# EAGLE schematic BB-Powersupply+KNX-Connection - v1.0.0 (EAGLE 9.6.2)
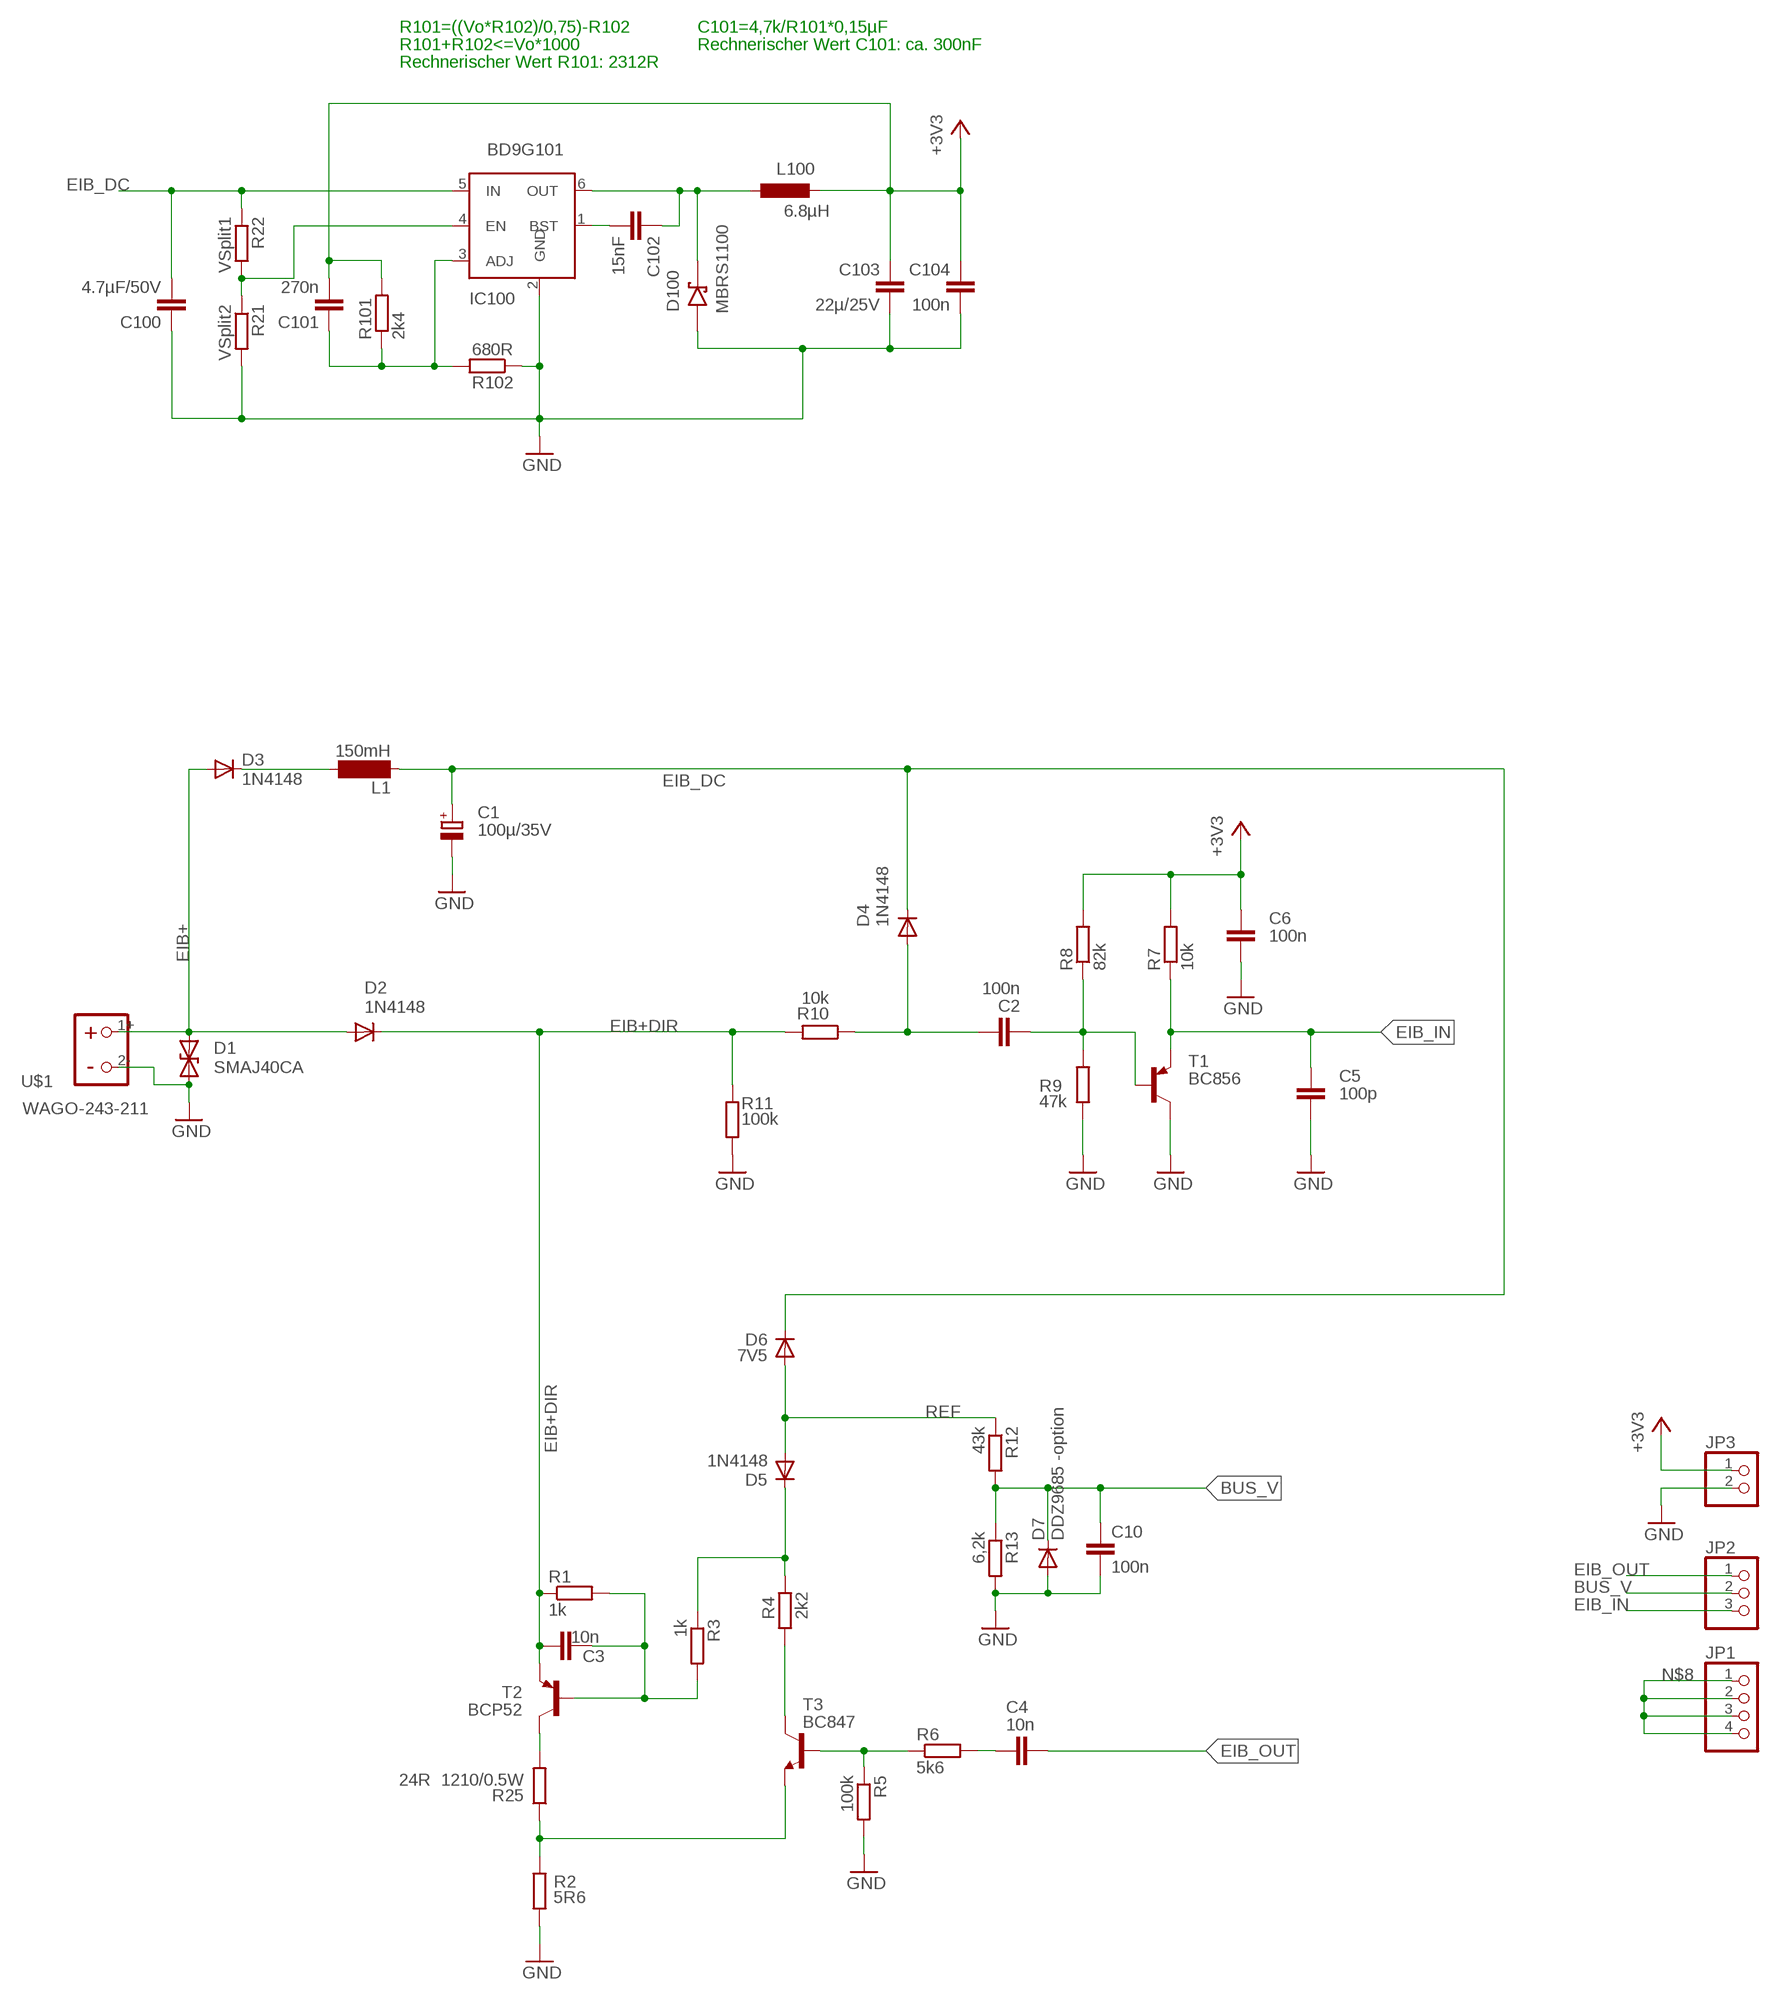
[diagram p0: schematic, sheet 1]

## Parts
C1  100µ/35V  CPOL-EUSANYO_SMD_C6  [SANYO-OSCON_SMD_C6]
C2  100n  C-EUC0805  [C0805]
C3  10n  C-EUC0805  [C0805]
C4  10n  C-EUC0805  [C0805]
C5  100p  C-EUC0805  [C0805]
C6  100n  C-EUC0805  [C0805]
C10  100n  C-EUC0805  [C0805]
C100  4.7µF/50V  C-EUC0805  [C0805]
C101  270n  C-EUC0805  [C0805]
C102  15nF  C-EUC0805  [C0805]
C103  22µ/25V  C-EUC1206  [C1206]
C104  100n  C-EUC0805  [C0805]
D1  SMAJ40CA  [DO214AC]
D2  1N4148  DIODESOD-123  [SOD-123]
D3  1N4148  DIODESOD-123  [SOD-123]
D4  1N4148  DIODESOD-123  [SOD-123]
D5  1N4148  DIODESOD-123  [SOD-123]
D6  7V5  DIODESOD-123  [SOD-123]
D7  DDZ9685 -option  DIODESOD-123  [SOD-123]
D100  MBRS1100  SCHOTTKY-DIODE-MBR130LSFT1  [SOD123FL]
IC100  BD9G101  BD9G101GBD9G101G-SOT23-6  [SOT23-6]
JP1  PINHD-1X4  [1X04]
JP2  PINHD-1X3  [1X03]
JP3  PINHD-1X2  [1X02]
L1  150mH  BS11  [BS11]
L100  6.8µH  L-EUL4532P  [L4532P]
R1  1k  R-EU_R0805  [R0805]
R2  5R6  R-EU_R0805  [R0805]
R3  1k  R-EU_R0805  [R0805]
R4  2k2  R-EU_R0805  [R0805]
R5  100k  R-EU_R0805  [R0805]
R6  5k6  R-EU_R0805  [R0805]
R7  10k  R-EU_R0805  [R0805]
R8  82k  R-EU_R0805  [R0805]
R9  47k  R-EU_R0805  [R0805]
R10  10k  R-EU_R0805  [R0805]
R11  100k  R-EU_R0805  [R0805]
R12  43k  R-EU_R0805  [R0805]
R13  6,2k  R-EU_R0805  [R0805]
R21  VSplit2  R-EU_R0805  [R0805]
R22  VSplit1  R-EU_R0805  [R0805]
R25  24R 1210/0.5W  R-EU_R2512  [R2512]
R101  2k4  R-EU_R0805  [R0805]
R102  680R  R-EU_R0805  [R0805]
T1  BC856  BC856BSMD  [SOT23-BEC]
T2  BCP52  FZT753SMD  [SOT223]
T3  BC847  [SOT23]
U$1  WAGO-243-211  [WAGO-243-211]

## Nets
+3V3: C6.2 C101.2 C103.1 C104.1 JP3.1 L100.2 R7.2 R8.2 R101.2
BST: C102.2 IC100.1(BST)
BUS_V: C10.2 D7.C JP2.2 R12.2 R13.1
EIB+: D1.C D2.A D3.A U$1.1+
EIB+DIR: C3.1 D2.C R1.1 R10.2 R11.2 T2.3(E)
EIB_DC: C1.+ C100.2 D4.C D6.C IC100.5(IN) L1.1 R22.1
EIB_IN: C5.2 JP2.3 R7.1 T1.E
EIB_OUT: C4.2 JP2.1
FB: C101.1 IC100.3(ADJ) R101.1 R102.2
GND: C1.- C5.1 C6.1 C10.1 C100.1 C103.2 C104.2 D1.A D7.A D100.A IC100.2(GND) JP3.2 R2.1 R5.2 R9.1 R11.1 R13.2 R21.2 R102.1 T1.C U$1.2-
LX: C102.1 D100.C IC100.6(OUT) L100.1
N$1: C2.2 D4.A R10.1
N$2: D3.C L1.2
N$3: C4.1 R6.2
N$5: IC100.4(EN) R21.1 R22.2
N$6: R4.1 T3.3(C)
N$7: R2.2 R25.1 T3.2(E)
N$8: JP1.1 JP1.2 JP1.3 JP1.4 R25.2 T2.2(C) T2.4(C)
N$12: R5.1 R6.1 T3.1(B)
N$14: C2.1 R8.1 R9.2 T1.B
N$15: C3.2 R1.2 R3.2 T2.1(B)
N$25: D5.C R3.1 R4.2
REF: D5.A D6.A R12.1

## Notes on the sheet
- R101=((Vo*R102)/0,75)-R102 | C101=4,7k/R101*0,15µF
- R101+R102<=Vo*1000 | Rechnerischer Wert C101: ca. 300nF
- Rechnerischer Wert R101: 2312R

## Library data of the parts
C1 = rcl:CPOL-EU: POLARIZED CAPACITOR, European symbol; REICHELT: VF 100/35 K-D8; SPICEPREFIX: C
C2 C10 C104 = rcl:C-EU: CAPACITOR, European symbol; REICHELT: X7R-G0805 100N; SPICEPREFIX: C
C3 C4 C6 = rcl:C-EU: CAPACITOR, European symbol; REICHELT: X7R-G0805 10N; SPICEPREFIX: C
C5 = rcl:C-EU: CAPACITOR, European symbol; REICHELT: NPO-G0805 100P; SPICEPREFIX: C
C100 = rcl:C-EU: CAPACITOR, European symbol; REICHELT: X7R-G1206 4,7/50; SPICEPREFIX: C
C101 = rcl:C-EU: CAPACITOR, European symbol; REICHELT: Y5R-G0603 220N; SPICEPREFIX: C
C102 = rcl:C-EU: CAPACITOR, European symbol; REICHELT: X7R-G0805 15N; SPICEPREFIX: C
C103 = rcl:C-EU: CAPACITOR, European symbol; REICHELT: X5R-G0805 22/6; SPICEPREFIX: C
D1 = smaj_10:SMAJ*CA: SMAJ Series TVS Diodes Source: http://www.littelfuse.com/~/media/electronics/datasheets/tvs_diodes/littelfuse_tvs_diode_smaj_datasheet.pdf.pdf; MF: Littelfuse; MPN: SMAJ40CA; OC_FARNELL: 1827675; OC_NEWARK: 71J2019
D2-D5 = microbuilder:DIODE: Diode SMA Model Volts Amps Type Vf Vr Digikey # Notes SSA34-E3 40V 3A Schottky 480mV @ 3A 200uA @ 40V SSA34-E3/61TGITR-ND CDBA120-G 20V 1A Schottky 500mV @ 1A 500uA @ 20V 641-1014-6-ND REEL MBRA210 10V 2A Schottky 350mV @ 2A 700uA @ 10V MBRA210LT3 SOD-123 Model Volts Amps Type Vf Vr Order # Notes BAT54T1G 30V 200mA Schottky 800mV @ 200mA 2uA @ 25V BAT54T1GOSTR-ND B0530W 30V 500mA Schottky 430mV @ 500mA 130uA @ 30V B0530W-FDICT-ND REEL MBR120 1A 20V Schottky 340mV @ 1A MBR120VLSFT1GOSCT-ND SOD-323 Model Volts Amps Type Vf Vr Order # Notes PMEG2005EJ 20V 500mA Schottky 355mV @ 500mA 568-4110-1-ND ZLLS410 10V 570mA Schottky 380mV @ 570mA ZLLS410CT-ND 1N4148WS 75V 150mA Silicon/Simple 1V 1N4148WSFSCT-ND REEL SOD-523 Model Volts Amps Type Vf Vr Order # Notes BAT54XV2 30V 200mA Schottky 0.8V @ 100mA BAT54XV2CT-ND TB751S 30V 30mA Schottky RB751S-40TE61CT-ND SOT23-R/W (R = Solder Paste/Reflow Ovens, W = Hand-Soldering) Model Volts Amps Type Vf Vr Order # Notes BAT54FILM 40V 300mA Schottky 497-7162-1-ND; REICHELT: 1N 4148 SMD
D6 = microbuilder:DIODE: Diode SMA Model Volts Amps Type Vf Vr Digikey # Notes SSA34-E3 40V 3A Schottky 480mV @ 3A 200uA @ 40V SSA34-E3/61TGITR-ND CDBA120-G 20V 1A Schottky 500mV @ 1A 500uA @ 20V 641-1014-6-ND REEL MBRA210 10V 2A Schottky 350mV @ 2A 700uA @ 10V MBRA210LT3 SOD-123 Model Volts Amps Type Vf Vr Order # Notes BAT54T1G 30V 200mA Schottky 800mV @ 200mA 2uA @ 25V BAT54T1GOSTR-ND B0530W 30V 500mA Schottky 430mV @ 500mA 130uA @ 30V B0530W-FDICT-ND REEL MBR120 1A 20V Schottky 340mV @ 1A MBR120VLSFT1GOSCT-ND SOD-323 Model Volts Amps Type Vf Vr Order # Notes PMEG2005EJ 20V 500mA Schottky 355mV @ 500mA 568-4110-1-ND ZLLS410 10V 570mA Schottky 380mV @ 570mA ZLLS410CT-ND 1N4148WS 75V 150mA Silicon/Simple 1V 1N4148WSFSCT-ND REEL SOD-523 Model Volts Amps Type Vf Vr Order # Notes BAT54XV2 30V 200mA Schottky 0.8V @ 100mA BAT54XV2CT-ND TB751S 30V 30mA Schottky RB751S-40TE61CT-ND SOT23-R/W (R = Solder Paste/Reflow Ovens, W = Hand-Soldering) Model Volts Amps Type Vf Vr Order # Notes BAT54FILM 40V 300mA Schottky 497-7162-1-ND; REICHELT: SMD ZF 7,5
D7 = microbuilder:DIODE: Diode SMA Model Volts Amps Type Vf Vr Digikey # Notes SSA34-E3 40V 3A Schottky 480mV @ 3A 200uA @ 40V SSA34-E3/61TGITR-ND CDBA120-G 20V 1A Schottky 500mV @ 1A 500uA @ 20V 641-1014-6-ND REEL MBRA210 10V 2A Schottky 350mV @ 2A 700uA @ 10V MBRA210LT3 SOD-123 Model Volts Amps Type Vf Vr Order # Notes BAT54T1G 30V 200mA Schottky 800mV @ 200mA 2uA @ 25V BAT54T1GOSTR-ND B0530W 30V 500mA Schottky 430mV @ 500mA 130uA @ 30V B0530W-FDICT-ND REEL MBR120 1A 20V Schottky 340mV @ 1A MBR120VLSFT1GOSCT-ND SOD-323 Model Volts Amps Type Vf Vr Order # Notes PMEG2005EJ 20V 500mA Schottky 355mV @ 500mA 568-4110-1-ND ZLLS410 10V 570mA Schottky 380mV @ 570mA ZLLS410CT-ND 1N4148WS 75V 150mA Silicon/Simple 1V 1N4148WSFSCT-ND REEL SOD-523 Model Volts Amps Type Vf Vr Order # Notes BAT54XV2 30V 200mA Schottky 0.8V @ 100mA BAT54XV2CT-ND TB751S 30V 30mA Schottky RB751S-40TE61CT-ND SOT23-R/W (R = Solder Paste/Reflow Ovens, W = Hand-Soldering) Model Volts Amps Type Vf Vr Order # Notes BAT54FILM 40V 300mA Schottky 497-7162-1-ND; REICHELT: SMD ZF 3,6
D100 = bt_diode:SCHOTTKY-DIODE: Schottky Diode; REICHELT: MBRS 1100 SMD
IC100 = Stefan_selfbus:BD9G101G
JP1 = pinhead_dmx:PINHD-1X4: PIN HEADER
JP2 = pinhead_dmx:PINHD-1X3: PIN HEADER
JP3 = pinhead_dmx:PINHD-1X2: PIN HEADER
L1 = dmx_inductor-neosid:BS: INDUCTOR nominal inductance, magnetically screened; OC_FARNELL: unknown; OC_NEWARK: unknown; REICHELT: L-11P 150M; SPICEPREFIX: L
L100 = rcl_changed:L-EU: INDUCTOR, European symbol; REICHELT: L-1616FPS 6,8µ; SPICEPREFIX: L
R1 R3 = rcl:R-EU_: RESISTOR, European symbol; REICHELT: SMD-0805 1,00K; SPICEPREFIX: R
R2 R25 = rcl:R-EU_: RESISTOR, European symbol; REICHELT: SMD-0805 5,60; SPICEPREFIX: R
R4 = rcl:R-EU_: RESISTOR, European symbol; REICHELT: SMD-0805 2,20K; SPICEPREFIX: R
R5 R11 = rcl:R-EU_: RESISTOR, European symbol; REICHELT: SMD-0805 100K; SPICEPREFIX: R
R6 = rcl:R-EU_: RESISTOR, European symbol; REICHELT: SMD-0805 5,60K; SPICEPREFIX: R
R7 R10 R13 = rcl:R-EU_: RESISTOR, European symbol; REICHELT: SMD-0805 10,0K; SPICEPREFIX: R
R8 = rcl:R-EU_: RESISTOR, European symbol; REICHELT: SMD-0805 82,0K; SPICEPREFIX: R
R9 = rcl:R-EU_: RESISTOR, European symbol; REICHELT: SMD-0805 47,0K; SPICEPREFIX: R
R12 = rcl:R-EU_: RESISTOR, European symbol; REICHELT: SMD 1/4W 91K; SPICEPREFIX: R
R21 R22 = rcl:R-EU_: RESISTOR, European symbol; SPICEPREFIX: R
R101 = rcl:R-EU_: RESISTOR, European symbol; REICHELT: SMD 1/4W 2,4K; SPICEPREFIX: R
R102 = rcl:R-EU_: RESISTOR, European symbol; REICHELT: SMD-0805 680; SPICEPREFIX: R
T1 = transistor-pnp:BC856*: PNP Transistror; REICHELT: BC 856B SMD
T2 = transistor-pnp:FZT753SMD: PNP Transistor; REICHELT: BCP 52-16 SMD
T3 = transistor:BC847: NPN TRANSISTOR; REICHELT: BC 847C SMD
U$1 = Connector_for_Selfbus-Projects:WAGO-243-211: WAGO KNX-Busklemme